# EAGLE design gpxtendo_rev2 (EAGLE 8.3.1)
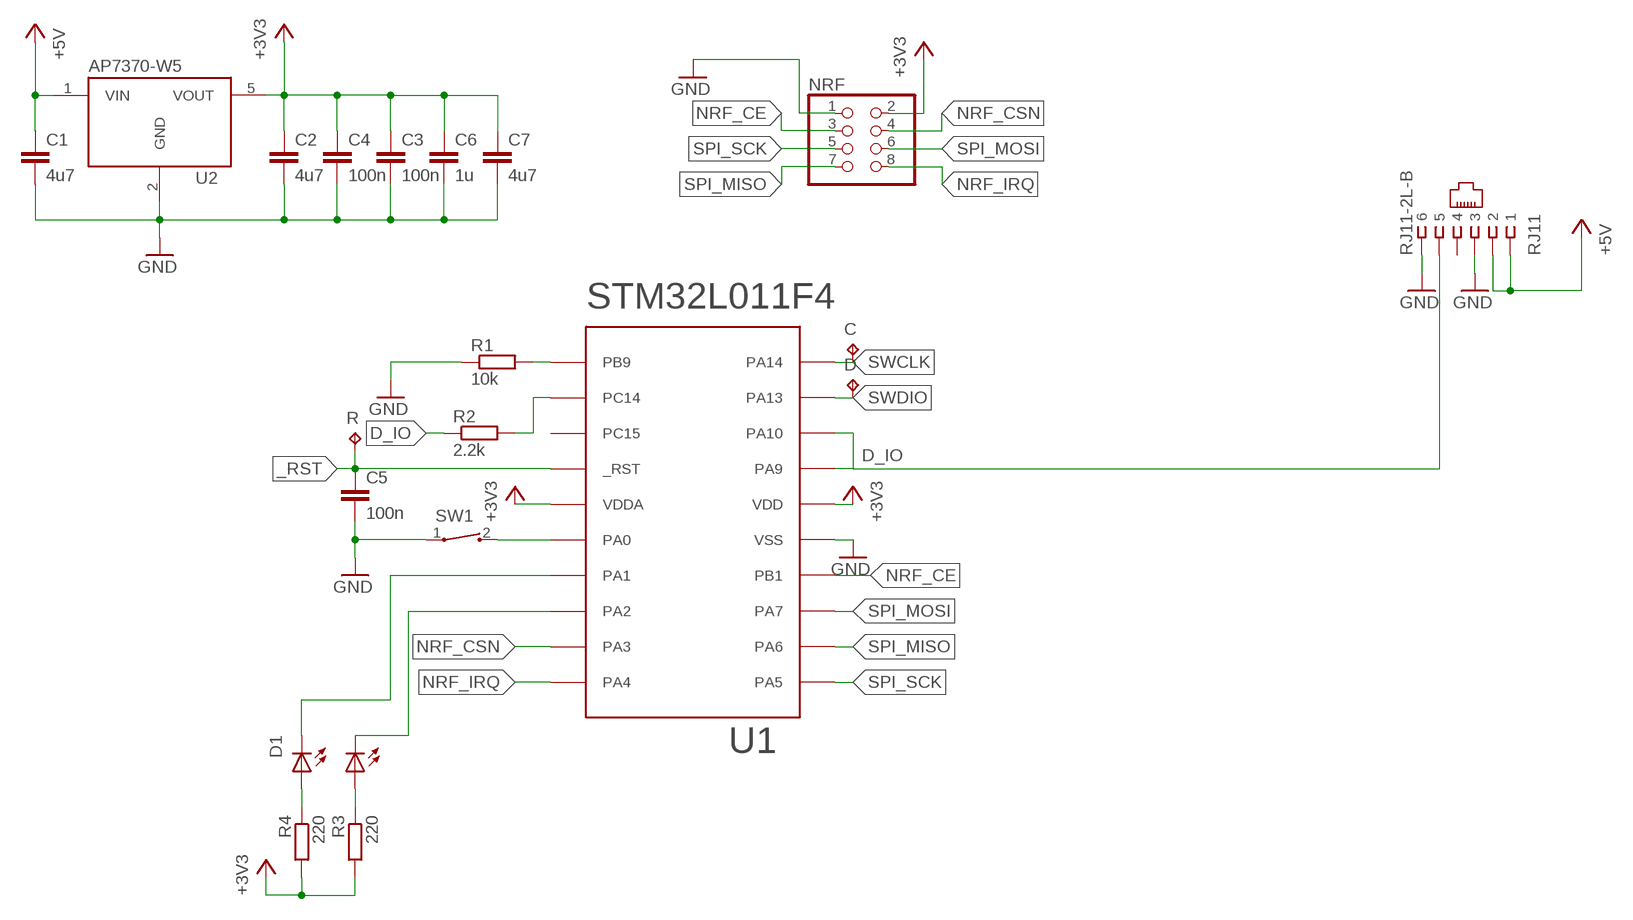
[diagram p0: schematic, sheet 1]

## Parts
C  TPTP10R  [TP10R]
C1  4u7  C0603-S  [C0603-S]
C2  4u7  C0603-S  [C0603-S]
C3  100n  C0603-S  [C0603-S]
C4  100n  C0603-S  [C0603-S]
C5  100n  C0603-S  [C0603-S]
C6  1u  C0603-S  [C0603-S]
C7  4u7  C0603-S  [C0603-S]
D  TPTP10R  [TP10R]
D1  LED-DUAL  [LED-1210]
NRF  PINHD-2X4  [2X04]
R  TPTP10R  [TP10R]
R1  10k  R0603-S  [R0603-S]
R2  2.2k  R0603-S  [R0603-S]
R3  220  R0603-S  [R0603-S]
R4  220  R0603-S  [R0603-S]
RJ11  RJ11-2L-B  [RJ11-NO_SHIELD]
SW1  SW-SPST  [TL3330]
U1  STM32L011F4PX  [TSSOP-20]
U2  AP7370-W5  [SOT23-5]

## Nets
+3V3: C2.1 C3.1 C4.1 C6.1 C7.1 NRF.2 R3.2 R4.2 U1.P$5(VDDA) U1.P$16(VDD) U2.5(VOUT)
+5V: C1.1 RJ11.1 RJ11.2 U2.1(VIN)
_RST: C5.1 R.TP U1.P$4(_RST)
BOOT0: R1.2 U1.P$1(PB9)
D_IO: R2.1 RJ11.5 U1.P$17(PA9) U1.P$18(PA10)
GND: C1.2 C2.2 C3.2 C4.2 C5.2 C6.2 C7.2 NRF.1 R1.1 RJ11.3 RJ11.6 SW1.1 U1.P$15(VSS) U2.2(GND)
N$3: D1.1(C0) U1.P$8(PA2)
N$4: D1.3(C1) U1.P$7(PA1)
N$6: D1.2(A0) R3.1
N$7: D1.4(A1) R4.1
N$8: SW1.2 U1.P$6(PA0)
NRF_CE: NRF.3 U1.P$14(PB1)
NRF_CSN: NRF.4 U1.P$9(PA3)
NRF_IRQ: NRF.8 U1.P$10(PA4)
PC14: R2.2 U1.P$2(PC14)
SPI_MISO: NRF.7 U1.P$12(PA6)
SPI_MOSI: NRF.6 U1.P$13(PA7)
SPI_SCK: NRF.5 U1.P$11(PA5)
SWCLK: C.TP U1.P$20(PA14)
SWDIO: D.TP U1.P$19(PA13)
Unconnected: RJ11.4 U1.P$3(PC15)

## Library data of the parts
C D R = testpad:TP: Test pad
C1-C7 = misc:C0603-S
D1 = misc:LED-DUAL
NRF = pinhead:PINHD-2X4: PIN HEADER
R1-R4 = misc:R0603-S
RJ11 = con-tycoelectronics:RJ11: CORCOM Modular RJ Jacks No Shield Source: www.tycoelectronics.com .. ENG_DS_1654001_1099_RJ_L_0507.pdf; MF: TYCO ELECTRONICS; MPN: RJ11-2L-B; OC_FARNELL: unknown; OC_NEWARK: 83F4463
SW1 = misc:SW-SPST
U1 = misc:STM32L011F4
U2 = misc:AP7370

## Board
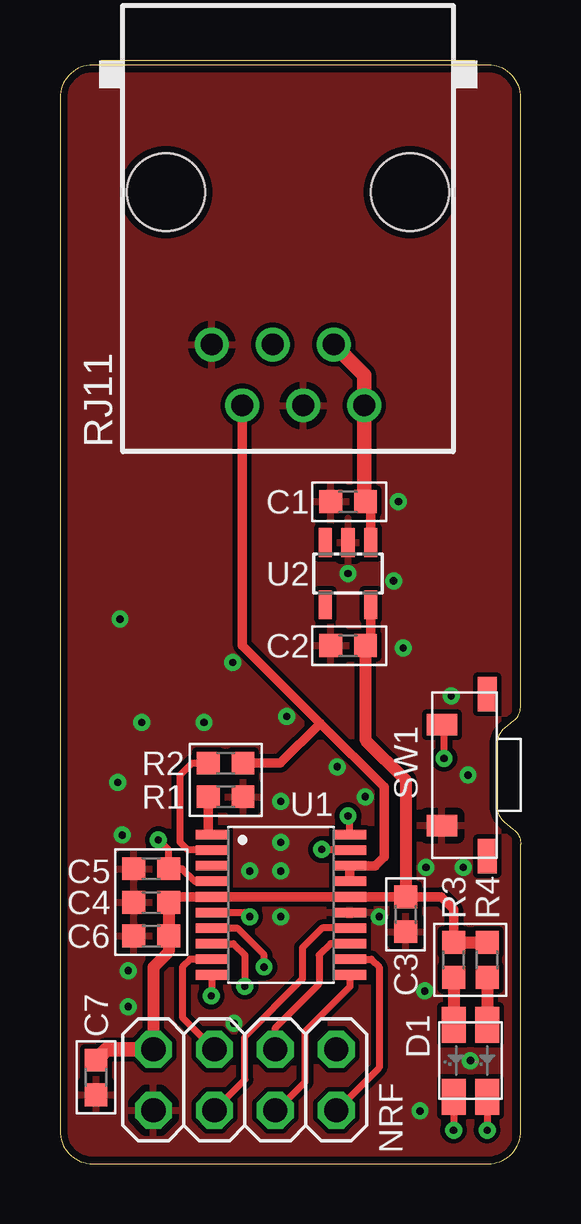
[diagram p1: board, top side]
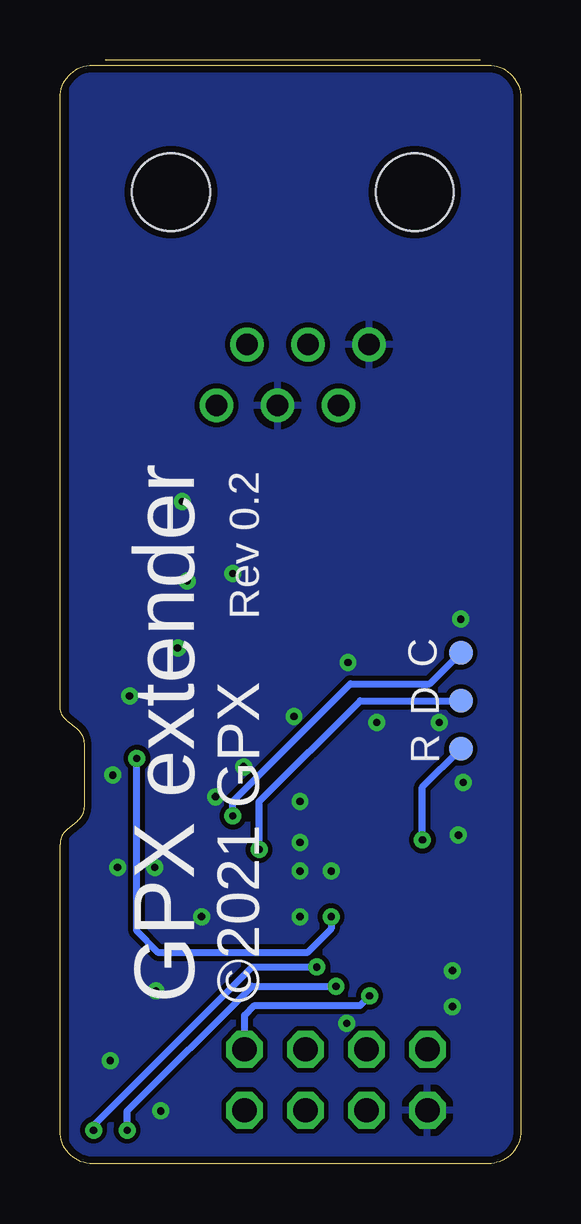
[diagram p2: board, bottom side, seen from below]

Size 19.2 x 45.8 mm. Coordinates in mm from the lower left corner, seen from the top.
Outline: 1.37,0 17.83,0 arc90 19.2,1.37 19.2,13.31 arc51 18.89,13.94 18.5,14.26 arc-51 18.2,14.89 18.2,17.51 arc-51 18.5,18.14 18.89,18.46 arc51 19.2,19.09 19.2,44.43 arc90 17.83,45.8 1.37,45.8 arc90 0,44.43 0,1.37 arc90 1.37,0
Copper layers (1*16): Top 0.035mm / dielectric 1.5mm / Bottom 0.035mm
Design rules "aisler *": minimum track width 0.1mm, minimum drill 0.3mm, track to track 0.2mm, track to pad 0.2mm, pad to pad 0.2mm, via to via 0.2mm, smd to smd 0.1mm, copper to edge 0.3mm, drill to drill 6mil, minimum pad ring 10mil, minimum via ring 8mil, stop-mask expansion 0.1mm, vias tented up to drill 99mm, thermal gap 0.3mm

### Footprints (pad centres in the part's own frame; a part is rotated, then mirrored left to right if it is on the bottom)
TP10R = smd 1 x 1: TP 0,0
C0603-S = smd 0.95 x 0.95: 1 -0.725,0; 2 0.725,0
LED-1210 = smd 1.5 x 1: 1 -1.5,0.7; 2 1.5,0.7; 3 -1.5,-0.7; 4 1.5,-0.7
2X04 = drill 1.016 octagon: 1 -3.81,-1.27; 2 -3.81,1.27; 3 -1.27,-1.27; 4 -1.27,1.27; 5 1.27,-1.27; 6 1.27,1.27; 7 3.81,-1.27; 8 3.81,1.27
R0603-S = smd 0.95 x 0.95: 1 -0.725,0; 2 0.725,0
RJ11-NO_SHIELD = drill 0.9 pad 1.4: 1 -3.175,8.89; 2 -1.905,6.35; 3 -0.635,8.89; 4 0.635,6.35; 5 1.905,8.89; 6 3.175,6.35 | hole 3.251: -5.08,0; 5.08,0
TL3330 = smd 0.9 x 1.27: 1 -2.1,0.885; 2 2.1,0.885 | smd 1.45 x 0.8: CH0 3.375,-1; CH1 -3.375,-1
TSSOP-20 = smd 0.4 x 1.35: P$1 -2.925,-2.875; P$2 -2.275,-2.875; P$3 -1.625,-2.875; P$4 -0.975,-2.875; P$5 -0.325,-2.875; P$6 0.325,-2.875; P$7 0.975,-2.875; P$8 1.625,-2.875; P$9 2.275,-2.875; P$10 2.925,-2.875; P$11 2.925,2.875; P$12 2.275,2.875; P$13 1.625,2.875; P$14 0.975,2.875; P$15 0.325,2.875; P$16 -0.325,2.875; P$17 -0.975,2.875; P$18 -1.625,2.875; P$19 -2.275,2.875; P$20 -2.925,2.875
SOT23-5 = smd 0.55 x 1.2: 1 -0.95,-1.3; 2 0,-1.3; 3 0.95,-1.3; 4 0.95,1.3; 5 -0.95,1.3

### Placement (x,y rotation side)
C  2.5,21.3 0 bottom
C1  12,27.6 180 top
C2  12,21.6 180 top
C3  14.4,10.4 270 top
C4  3.8,10.9 180 top
C5  3.8,12.3 180 top
C6  3.8,9.5 180 top
C7  1.5,3.6 270 top
D  2.5,19.3 0 bottom
D1  17.1,4.3 90 top
NRF  7.7,3.5 0 top
R  2.5,17.3 0 bottom
R1  6.9,15.3 180 top
R2  6.9,16.7 180 top
R3  16.4,8.5 90 top
R4  17.8,8.5 90 top
RJ11  9.5,40.5 180 top
SW1  16.8,16.2 90 top
U1  9.2,10.8 270 top
U2  12,24.6 180 top

### Tracks (layer width: path | path; a pad name or v marks a point on that pad's centre or on a via)
+3V3
  Top 0.3: 4.65,11.12 4.65,11.03 C4.1
  Top 0.4: 4.65,11.12 U1.P$5 U1.P$16 C3.1 14.57,11.12 | 14.57,11.12 15.88,11.12 16.4,10.6 R3.2 | U2.5 12.95,21.82 C2.1 | 14.4,11.29 14.57,11.12
  Top 0.5: C4.1 C6.1 4.53,8.82 3.89,8.19 NRF.2 | R3.2 R4.2 | C2.1 12.72,17.68 14.4,16 14.4,11.29
  Top 0.6: NRF.2 1.95,4.77 C7.1
+5V
  Top 0.4: U2.1 12.95,27.38 12.87,27.46 | 12.87,27.46 C1.1 | 12.68,27.65 12.87,27.46
  Top 0.6: RJ11.2 12.68,32.88 RJ11.1 12.68,27.65
_RST  (via drill 0.3)
  Top 0.3: U1.P$4 5.61,11.78 5.08,12.3 C5.1 4.53,13.07 v4.1,13.5
  Bottom 0.3: v4.1,13.5 4.1,15.7 R.TP
BOOT0
  Top 0.4: R1.2 6.17,13.88 U1.P$1
D_IO
  Top 0.4: U1.P$17 U1.P$18 13.12,12.43 13.5,12.8 13.5,15.7 10.84,18.36 | RJ11.5 7.59,21.61 10.84,18.36 | R2.1 9.18,16.7 10.84,18.36
GND  (via drill 0.3)
  other vias: 12,24.6 14.1,27.6 13.9,24.3 17.1,4.3 13.3,10.3 15,2.2 17,16.2 9.2,12.2 9.2,10.3 7.25,5.85 15.25,12.35 14.3,21.5 16.3,19.5 2.6,13.7 9.2,13.4 7.9,12.2 2.85,8.05 2.85,6.55 12.72,15.3 15.2,7.2 2.5,22.7 3.4,18.4 2.4,15.9 7.2,20.9 6,18.4 9.2,15.1 11.55,16.55 9.45,18.65 16.8,12.35
  pour Top: 0,0 18.7,0 18.7,45.7 0,45.7
  pour Bottom: 18.7,0 0,0 0,45.7 18.7,45.7
N$3  (via drill 0.3)
  Top 0.3: D1.1 v16.4,1.4 | v7.7,7.4 7.7,8.7 7.22,9.18 U1.P$8
  Bottom 0.3: v16.4,1.4 16.4,2.2 11.2,7.4 v7.7,7.4
N$4  (via drill 0.3)
  Top 0.3: D1.3 v17.8,1.4 | v8.5,8.2 8.5,8.7 7.38,9.82 U1.P$7
  Bottom 0.3: v17.8,1.4 17.8,1.6 11.2,8.2 v8.5,8.2
N$6
  Top 0.5: R3.1 D1.2
N$7
  Top 0.5: R4.1 D1.4
N$8  (via drill 0.3)
  Top 0.3: U1.P$6 7.72,10.47 v7.9,10.3 | v16,16.9 16,18.21 SW1.2
  Bottom 0.3: v7.9,10.3 7.9,9.8 8.9,8.8 15.1,8.8 16,9.7 v16,16.9
NRF_CE
  Top 0.3: NRF.3 7.7,3.5 7.7,5.3 10.1,7.7 10.1,9 10.93,9.82 U1.P$14
NRF_CSN
  Top 0.3: NRF.4 5.1,6.1 5.1,8.2 5.42,8.53 U1.P$9
NRF_IRQ  (via drill 0.3)
  Top 0.3: U1.P$10 6.33,7.03 v6.3,7
  Bottom 0.3: NRF.8 11.51,6.19 11.1,6.6 6.7,6.6 v6.3,7
PC14
  Top 0.3: U1.P$2 5.33,13.07 5,13.4 5,16.2 5.5,16.7 R2.2
SPI_MISO
  Top 0.3: NRF.7 11.53,2.23 13.3,4 13.3,8.2 12.97,8.53 U1.P$12
SPI_MOSI
  Top 0.3: NRF.6 8.97,5.67 10.8,7.5 10.8,8.7 11.28,9.18 U1.P$13
SPI_SCK
  Top 0.3: NRF.5 9.03,2.23 10.2,3.4 10.2,5.5 12.07,7.38 U1.P$11
SWCLK  (via drill 0.3)
  Top 0.3: U1.P$20 12.07,14.43 v12,14.5
  Bottom 0.3: v12,14.5 12,15.1 7.1,20 3.8,20 C.TP
SWDIO  (via drill 0.3)
  Top 0.3: U1.P$19 10.93,13.07 v10.9,13.1
  Bottom 0.3: v10.9,13.1 10.9,15.1 6.7,19.3 D.TP

### Text on the board
bPlace: Rev 0.2 | ©2021 GPX | GPX extender